# EasyEDA Pro project FrameworkGPU to MXM V0.4.epro, schematic Schematic1
Board Name: PCB3; Create Date: 2025-08-14; Page Name: P1; Project Name: FrameworkGPU to MXM V0.1; Schematic Name: Schematic1; Update Date: 2025-08-20; Company: EasyEDA.com; Page Size: A4; Version: V0.1
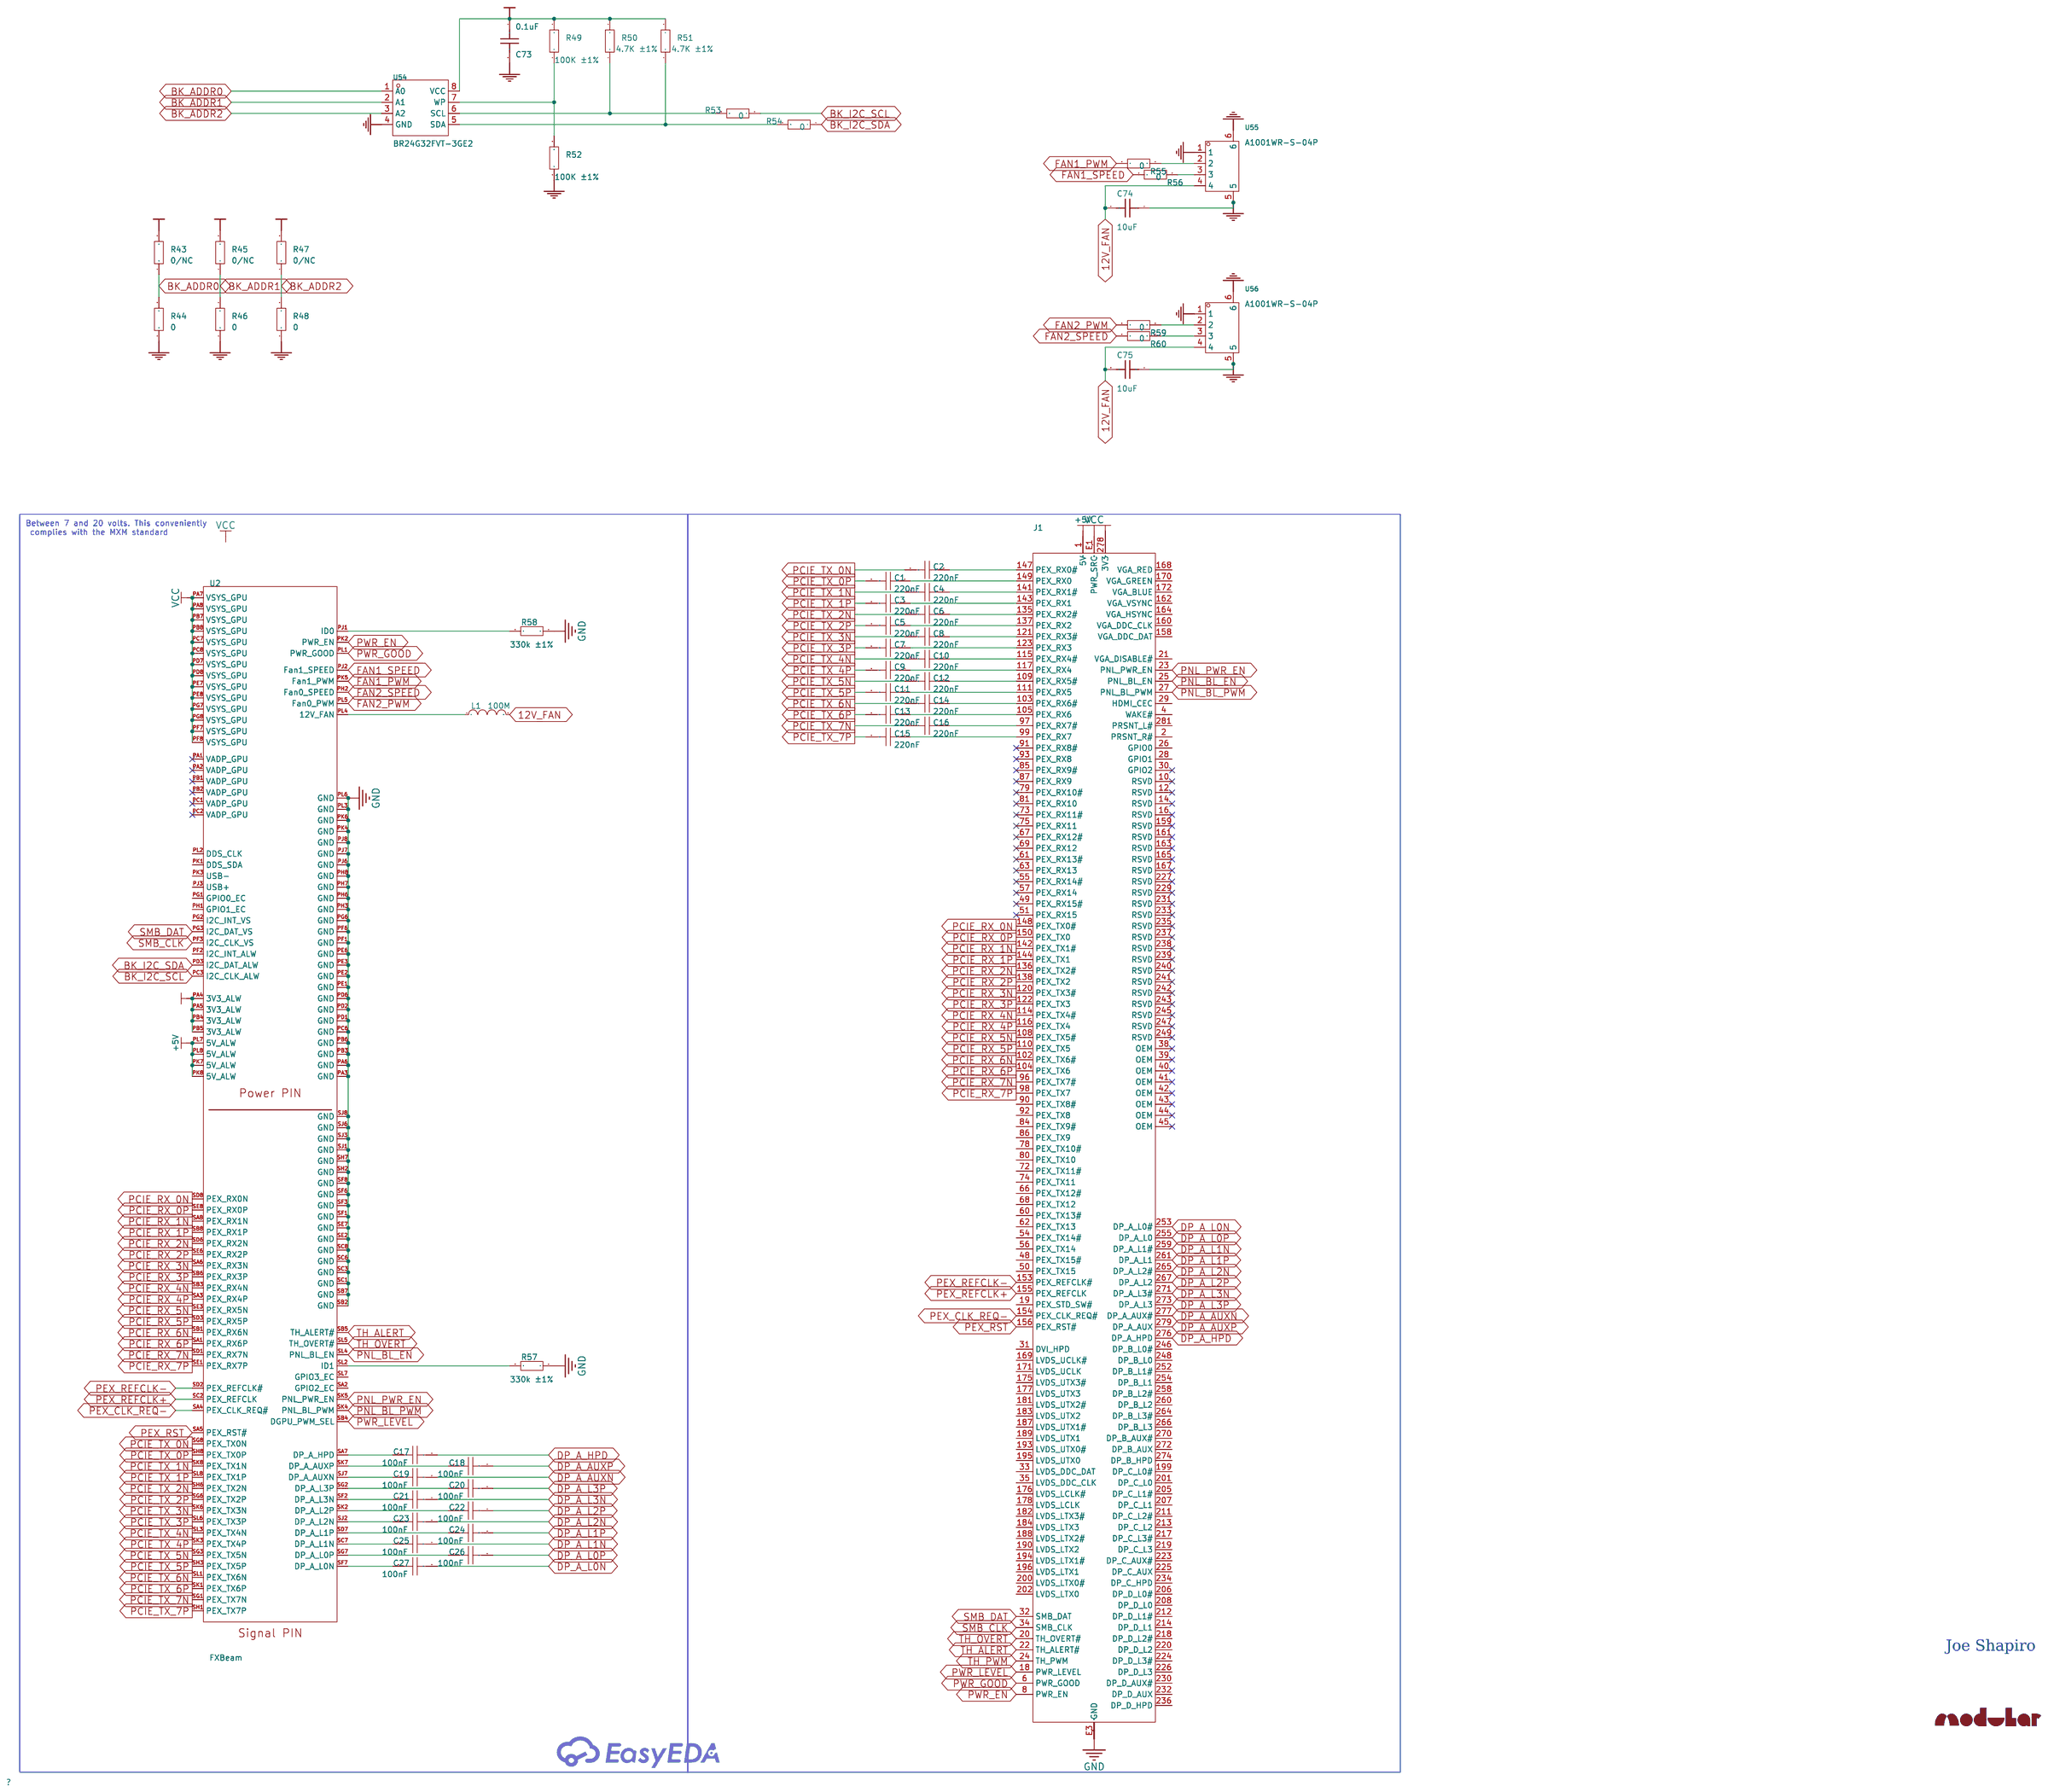
[diagram p0: schematic sheet]

## Parts
C1  220nF  [C0402]
C2  220nF  [C0402]
C3  220nF  [C0402]
C4  220nF  [C0402]
C5  220nF  [C0402]
C6  220nF  [C0402]
C7  220nF  [C0402]
C8  220nF  [C0402]
C9  220nF  [C0402]
C10  220nF  [C0402]
C11  220nF  [C0402]
C12  220nF  [C0402]
C13  220nF  [C0402]
C14  220nF  [C0402]
C15  220nF  [C0402]
C16  220nF  [C0402]
C17  100nF  [C0603]
C18  100nF  [C0603]
C19  100nF  [C0603]
C20  100nF  [C0603]
C21  100nF  [C0603]
C22  100nF  [C0603]
C23  100nF  [C0603]
C24  100nF  [C0603]
C25  100nF  [C0603]
C26  100nF  [C0603]
C27  100nF  [C0603]
C73  0.1uF  [C0402]
C74  10uF  [C0402]
C75  10uF  [C0402]
J1  MXM3.0  [CONN-SMD_314P-P0.50_10151114-001TLF]
L1  100M  [L0603]
R43  0/NC  [R0402]
R44  0  [R0402]
R45  0/NC  [R0402]
R46  0  [R0402]
R47  0/NC  [R0402]
R48  0  [R0402]
R49  100K ±1%  [R0402]
R50  4.7K ±1%  [R0402]
R51  4.7K ±1%  [R0402]
R52  100K ±1%  [R0402]
R53  0  [R0402]
R54  0  [R0402]
R55  0  [R0402]
R56  0  [R0402]
R57  330k ±1%  [R0402]
R58  330k ±1%  [R0402]
R59  0  [R0402]
R60  0  [R0402]
U2  FXBeam  [FW_FXBEAM_FULL]
U54  BR24G32FVT-3GE2  [TSSOP-8_L4.4-W3.0-P0.65-LS6.4-BL]
U55  A1001WR-S-04P  [CONN-SMD_A1001WR-S-04P]
U56  A1001WR-S-04P  [CONN-SMD_A1001WR-S-04P]

## Library data of the parts
C1-C27 = CAP_0603: Supplier Footprint: 0603
C73-C75 = 0.1uF: nameAlias: Value(F); Contributor: LCEDA_Lib; spicePre: C; spiceSymbolName: C_0603_US
J1 = MXM3.0
L1 = L_0603
R43-R60 = Res_0603: Supplier Footprint: 0603
U2 = FXBeam
U54 = BR24G32FVT-3GE2: Interface Type:I2C Memory Size:32Kbit Supply Voltage:1.6V~5.5V Supply Voltage:1.6V~5.5V Operating Temperature:-40℃~+85℃ Operating Temperature:-40℃~+85℃; Supplier Part: C2061284; Manufacturer: ROHM(罗姆); Supplier Footprint: TSSOP-8; JLCPCB Part Class: Extended Part; Datasheet: https://atta.szlcsc.com/upload/public/pdf/source/20211207/04F260C112D11C6089B8D1D4B01C0AA6.pdf; Supplier: LCSC; Interface Type: I2C; Memory Size: 32Kbit; Supply Voltage: 1.6V~5.5V; Operating Temperature: -40℃~+85℃
U55 U56 = A1001WR-S-04P: Pins Structure:1x4P Pitch:1mm Mounting Style:- Reference Series:- Number of Pins:4P Number of Rows:1 Number of PINs Per Row:4 Row Spacing:- Contact Material:Phosphor bronze; Supplier Part: C371510; Manufacturer: HR(灿达); Supplier Footprint: SMD,P=1mm; JLCPCB Part Class: Extended Part; Datasheet: https://atta.szlcsc.com/upload/public/pdf/source/20190214/C371578_09AF42C08FED26B3913BACEA5FD69D33.pdf; Supplier: LCSC; Pins Structure: 1x4P; Pitch: 1mm; Number of Pins: 4P; Number of Rows: 1; Number of PINs Per Row: 4; Contact Material: Phosphor bronze

## Nets
12V_FAN: C74.2 C75.2 L1.2 U55.4 U56.4
+3.3V: C73.1 J1.278(3V3) J1.280(3V3) R43.2 R45.2 R47.2 R49.2 R50.2 R51.2 U2.PA4(3V3_ALW) U2.PA5(3V3_ALW) U2.PB4(3V3_ALW) U2.PB5(3V3_ALW) U54.8(VCC)
+5V: J1.1(5V) J1.3(5V) J1.5(5V) J1.7(5V) J1.9(5V) U2.PK7(5V_ALW) U2.PK8(5V_ALW) U2.PL7(5V_ALW) U2.PL8(5V_ALW)
GND: C73.2 C74.1 C75.1 J1.11(GND) J1.13(GND) J1.15(GND) J1.17(GND) J1.36(GND) J1.37(GND) J1.46(GND) J1.47(GND) J1.52(GND) J1.53(GND) J1.58(GND) J1.59(GND) J1.64(GND) J1.65(GND) J1.70(GND) J1.71(GND) J1.76(GND) J1.77(GND) J1.82(GND) J1.83(GND) J1.88(GND) J1.89(GND) J1.94(GND) J1.95(GND) J1.100(GND) J1.101(GND) J1.106(GND) J1.107(GND) J1.112(GND) J1.113(GND) J1.118(GND) J1.119(GND) J1.124(GND) J1.125(GND) J1.133(GND) J1.134(GND) J1.139(GND) J1.140(GND) J1.145(GND) J1.146(GND) J1.151(GND) J1.152(GND) J1.157(GND) J1.166(GND) J1.173(GND) J1.174(GND) J1.179(GND) J1.180(GND) J1.185(GND) J1.186(GND) J1.191(GND) J1.192(GND) J1.197(GND) J1.198(GND) J1.203(GND) J1.204(GND) J1.209(GND) J1.210(GND) J1.215(GND) J1.216(GND) J1.221(GND) J1.222(GND) J1.228(GND) J1.244(GND) J1.250(GND) J1.251(GND) J1.256(GND) J1.257(GND) J1.262(GND) J1.263(GND) J1.268(GND) J1.269(GND) J1.275(GND) J1.E3(GND) J1.E4(GND) R44.1 R46.1 R48.1 R52.1 R57.1 R58.1 U2.PA3(GND) U2.PA6(GND) U2.PB3(GND) U2.PB6(GND) U2.PC6(GND) U2.PD1(GND) U2.PD2(GND) U2.PD6(GND) U2.PE1(GND) U2.PE2(GND) U2.PE3(GND) U2.PE6(GND) U2.PF1(GND) U2.PF6(GND) U2.PG6(GND) U2.PH3(GND) U2.PH6(GND) U2.PH7(GND) U2.PH8(GND) U2.PJ6(GND) U2.PJ7(GND) U2.PJ8(GND) U2.PK4(GND) U2.PK6(GND) U2.PL3(GND) U2.PL6(GND) U2.SB2(GND) U2.SB7(GND) U2.SC1(GND) U2.SC3(GND) U2.SC6(GND) U2.SC8(GND) U2.SE2(GND) U2.SE7(GND) U2.SF1(GND) U2.SF3(GND) U2.SF6(GND) U2.SF8(GND) U2.SH2(GND) U2.SH7(GND) U2.SJ1(GND) U2.SJ3(GND) U2.SJ6(GND) U2.SJ8(GND) U54.4(GND) U55.1 U55.5 U55.6 U56.1 U56.5 U56.6
VCC: J1.E1(PWR_SRC) J1.E2(PWR_SRC) U2.PA7(VSYS_GPU) U2.PA8(VSYS_GPU) U2.PB7(VSYS_GPU) U2.PB8(VSYS_GPU) U2.PC7(VSYS_GPU) U2.PC8(VSYS_GPU) U2.PD7(VSYS_GPU) U2.PD8(VSYS_GPU) U2.PE7(VSYS_GPU) U2.PE8(VSYS_GPU) U2.PF7(VSYS_GPU) U2.PF8(VSYS_GPU) U2.PG7(VSYS_GPU) U2.PG8(VSYS_GPU)
BK_ADDR0: R43.1 R44.2 U54.1(A0)
BK_ADDR1: R45.1 R46.2 U54.2(A1)
BK_ADDR2: R47.1 R48.2 U54.3(A2)
BK_I2C_SCL: R53.1 U2.PC3(I2C_CLK_ALW)
BK_I2C_SDA: R54.1 U2.PD3(I2C_DAT_ALW)
DP_A_AUXN: C19.1 J1.277(DP_A_AUX#)
DP_A_AUXP: C18.1 J1.279(DP_A_AUX)
DP_A_HPD: C17.1 J1.276(DP_A_HPD)
DP_A_L0N: C27.1 J1.253(DP_A_L0#)
DP_A_L0P: C26.1 J1.255(DP_A_L0)
DP_A_L1N: C25.1 J1.259(DP_A_L1#)
DP_A_L1P: C24.1 J1.261(DP_A_L1)
DP_A_L2N: C23.1 J1.265(DP_A_L2#)
DP_A_L2P: C22.1 J1.267(DP_A_L2)
DP_A_L3N: C21.1 J1.271(DP_A_L3#)
DP_A_L3P: C20.1 J1.273(DP_A_L3)
FAN1_PWM: R55.2 U2.PK5(Fan1_PWM)
FAN1_SPEED: R56.1 R56.2 U2.PJ2(Fan1_SPEED) U55.3
FAN2_PWM: R59.2 U2.PL5(Fan0_PWM)
FAN2_SPEED: R60.2 U2.PH2(Fan0_SPEED)
PCIE_RX_0N: J1.148(PEX_TX0#) U2.SD8(PEX_RX0N)
PCIE_RX_0P: J1.150(PEX_TX0) U2.SE8(PEX_RX0P)
PCIE_RX_1N: J1.142(PEX_TX1#) U2.SA8(PEX_RX1N)
PCIE_RX_1P: J1.144(PEX_TX1) U2.SB8(PEX_RX1P)
PCIE_RX_2N: J1.136(PEX_TX2#) U2.SD6(PEX_RX2N)
PCIE_RX_2P: J1.138(PEX_TX2) U2.SE6(PEX_RX2P)
PCIE_RX_3N: J1.120(PEX_TX3#) U2.SA6(PEX_RX3N)
PCIE_RX_3P: J1.122(PEX_TX3) U2.SB6(PEX_RX3P)
PCIE_RX_4N: J1.114(PEX_TX4#) U2.SB3(PEX_RX4N)
PCIE_RX_4P: J1.116(PEX_TX4) U2.SA3(PEX_RX4P)
PCIE_RX_5N: J1.108(PEX_TX5#) U2.SE3(PEX_RX5N)
PCIE_RX_5P: J1.110(PEX_TX5) U2.SD3(PEX_RX5P)
PCIE_RX_6N: J1.102(PEX_TX6#) U2.SB1(PEX_RX6N)
PCIE_RX_6P: J1.104(PEX_TX6) U2.SA1(PEX_RX6P)
PCIE_RX_7N: J1.96(PEX_TX7#) U2.SD1(PEX_RX7N)
PCIE_RX_7P: J1.98(PEX_TX7) U2.SE1(PEX_RX7P)
PCIE_TX_0N: C2.2 U2.SG8(PEX_TX0N)
PCIE_TX_0P: C1.2 U2.SH8(PEX_TX0P)
PCIE_TX_1N: C4.2 U2.SK8(PEX_TX1N)
PCIE_TX_1P: C3.2 U2.SL8(PEX_TX1P)
PCIE_TX_2N: C6.2 U2.SH6(PEX_TX2N)
PCIE_TX_2P: C5.2 U2.SG6(PEX_TX2P)
PCIE_TX_3N: C8.2 U2.SK6(PEX_TX3N)
PCIE_TX_3P: C7.2 U2.SL6(PEX_TX3P)
PCIE_TX_4N: C10.2 U2.SL3(PEX_TX4N)
PCIE_TX_4P: C9.2 U2.SK3(PEX_TX4P)
PCIE_TX_5N: C12.2 U2.SG3(PEX_TX5N)
PCIE_TX_5P: C11.2 U2.SH3(PEX_TX5P)
PCIE_TX_6N: C14.2 U2.SL1(PEX_TX6N)
PCIE_TX_6P: C13.2 U2.SK1(PEX_TX6P)
PCIE_TX_7N: C16.2 U2.SG1(PEX_TX7N)
PCIE_TX_7P: C15.2 U2.SH1(PEX_TX7P)
PEX_CLK_REQ-: J1.154(PEX_CLK_REQ#) U2.SA4(PEX_CLK_REQ#)
PEX_REFCLK+: J1.155(PEX_REFCLK) U2.SC2(PEX_REFCLK)
PEX_REFCLK-: J1.153(PEX_REFCLK#) U2.SD2(PEX_REFCLK#)
PEX_RST: J1.156(PEX_RST#) U2.SA5(PEX_RST#)
PNL_BL_EN: J1.25(PNL_BL_EN) U2.SL4(PNL_BL_EN)
PNL_BL_PWM: J1.27(PNL_BL_PWM) U2.SK4(PNL_BL_PWM)
PNL_PWR_EN: J1.23(PNL_PWR_EN) U2.SK5(PNL_PWR_EN)
PWR_EN: J1.8(PWR_EN) U2.PK2(PWR_EN)
PWR_GOOD: J1.6(PWR_GOOD) U2.PL1(PWR_GOOD)
PWR_LEVEL: J1.18(PWR_LEVEL) U2.SB4(DGPU_PWM_SEL)
SMB_CLK: J1.34(SMB_CLK) U2.PF3(I2C_CLK_VS)
SMB_DAT: J1.32(SMB_DAT) U2.PG3(I2C_DAT_VS)
TH_ALERT: J1.22(TH_ALERT#) U2.SB5(TH_ALERT#)
TH_OVERT: J1.20(TH_OVERT#) U2.SL5(TH_OVERT#)
TH_PWM: J1.24(TH_PWM)
$1N3802: C2.1 J1.147(PEX_RX0#)
$1N3808: C1.1 J1.149(PEX_RX0)
$1N3862: C3.1 J1.143(PEX_RX1)
$1N3868: C4.1 J1.141(PEX_RX1#)
$1N3922: C5.1 J1.137(PEX_RX2)
$1N3928: C6.1 J1.135(PEX_RX2#)
$1N3982: C7.1 J1.123(PEX_RX3)
$1N3988: C8.1 J1.121(PEX_RX3#)
$1N4042: C9.1 J1.117(PEX_RX4)
$1N4048: C10.1 J1.115(PEX_RX4#)
$1N4102: C11.1 J1.111(PEX_RX5)
$1N4108: C12.1 J1.109(PEX_RX5#)
$1N4162: C13.1 J1.105(PEX_RX6)
$1N4168: C14.1 J1.103(PEX_RX6#)
$1N4222: C15.1 J1.99(PEX_RX7)
$1N4228: C16.1 J1.97(PEX_RX7#)
$1N13346: C17.2 U2.SA7(DP_A_HPD)
$1N13376: C18.2 U2.SK7(DP_A_AUXP)
$1N13406: C19.2 U2.SJ7(DP_A_AUXN)
$1N13436: C20.2 U2.SG2(DP_A_L3P)
$1N13542: C22.2 U2.SK2(DP_A_L2P)
$1N13548: C21.2 U2.SF2(DP_A_L3N)
$1N13602: C24.2 U2.SD7(DP_A_L1P)
$1N13608: C23.2 U2.SJ2(DP_A_L2N)
$1N13662: C26.2 U2.SG7(DP_A_L0P)
$1N13668: C25.2 U2.SC7(DP_A_L1N)
$1N13722: C27.2 U2.SF7(DP_A_L0N)
$1N16911: R49.1 R52.2 U54.7(WP)
$1N16916: R50.1 R53.2 U54.6(SCL)
$1N16922: R51.1 R54.2 U54.5(SDA)
$1N17452: R55.1 U55.2
$1N17626: R57.2 U2.SL2(ID1)
$1N19602: R58.2 U2.PJ1(ID0)
$1N19683: R60.1 U56.3
$1N19689: R59.1 U56.2
$1N19713: L1.1 U2.PL4(12V_FAN)

Not connected (* = marked no-connect by the designer): J1 2(PRSNT_R#) 4(WAKE#) 10(RSVD)* 12(RSVD)* 14(RSVD)* 16(RSVD)* 19(PEX_STD_SW#) 21(VGA_DISABLE#) 26(GPIO0) 28(GPIO1) 29(HDMI_CEC) 30(GPIO2)* 31(DVI_HPD) 33(LVDS_DDC_DAT) 35(LVDS_DDC_CLK) 38(OEM)* 39(OEM)* 40(OEM)* 41(OEM)* 42(OEM)* 43(OEM)* 44(OEM)* 45(OEM)* 48(PEX_TX15#) 49(PEX_RX15#)* 50(PEX_TX15) 51(PEX_RX15)* 54(PEX_TX14#) 55(PEX_RX14#)* 56(PEX_TX14) 57(PEX_RX14)* 60(PEX_TX13#) 61(PEX_RX13#)* 62(PEX_TX13) 63(PEX_RX13)* 66(PEX_TX12#) 67(PEX_RX12#)* 68(PEX_TX12) 69(PEX_RX12)* 72(PEX_TX11#) 73(PEX_RX11#)* 74(PEX_TX11) 75(PEX_RX11)* 78(PEX_TX10#) 79(PEX_RX10#)* 80(PEX_TX10) 81(PEX_RX10)* 84(PEX_TX9#) 85(PEX_RX9#)* 86(PEX_TX9) 87(PEX_RX9)* 90(PEX_TX8#) 91(PEX_RX8#)* 92(PEX_TX8) 93(PEX_RX8)* 158(VGA_DDC_DAT) 159(RSVD)* 160(VGA_DDC_CLK) 161(RSVD)* 162(VGA_VSYNC) 163(RSVD)* 164(VGA_HSYNC) 165(RSVD)* 167(RSVD)* 168(VGA_RED) 169(LVDS_UCLK#) 170(VGA_GREEN) 171(LVDS_UCLK) 172(VGA_BLUE) 175(LVDS_UTX3#) 176(LVDS_LCLK#) 177(LVDS_UTX3) 178(LVDS_LCLK) 181(LVDS_UTX2#) 182(LVDS_LTX3#) 183(LVDS_UTX2) 184(LVDS_LTX3) 187(LVDS_UTX1#) 188(LVDS_LTX2#) 189(LVDS_UTX1) 190(LVDS_LTX2) 193(LVDS_UTX0#) 194(LVDS_LTX1#) 195(LVDS_UTX0) 196(LVDS_LTX1) 199(DP_C_L0#) 200(LVDS_LTX0#) 201(DP_C_L0) 202(LVDS_LTX0) 205(DP_C_L1#) 206(DP_D_L0#) 207(DP_C_L1) 208(DP_D_L0) 211(DP_C_L2#) 212(DP_D_L1#) 213(DP_C_L2) 214(DP_D_L1) 217(DP_C_L3#) 218(DP_D_L2#) 219(DP_C_L3) 220(DP_D_L2) 223(DP_C_AUX#) 224(DP_D_L3#) 225(DP_C_AUX) 226(DP_D_L3) 227(RSVD)* 229(RSVD)* 230(DP_D_AUX#) 231(RSVD)* 232(DP_D_AUX) 233(RSVD)* 234(DP_C_HPD) 235(RSVD)* 236(DP_D_HPD) 237(RSVD)* 238(RSVD)* 239(RSVD)* 240(RSVD)* 241(RSVD)* 242(RSVD)* 243(RSVD)* 245(RSVD)* 246(DP_B_L0#) 247(RSVD)* 248(DP_B_L0) 249(RSVD)* 252(DP_B_L1#) 254(DP_B_L1) 258(DP_B_L2#) 260(DP_B_L2) 264(DP_B_L3#) 266(DP_B_L3) 270(DP_B_AUX#) 272(DP_B_AUX) 274(DP_B_HPD) 281(PRSNT_L#); U2 PA1(VADP_GPU)* PA2(VADP_GPU)* PB1(VADP_GPU)* PB2(VADP_GPU)* PC1(VADP_GPU)* PC2(VADP_GPU)* PF2(I2C_INT_ALW) PG1(GPIO0_EC) PG2(I2C_INT_VS) PH1(GPIO1_EC) PJ3(USB+) PK1(DDS_SDA) PK3(USB-) PL2(DDS_CLK) SA2(GPIO2_EC) SL7(GPIO3_EC)

## Notes on the sheet
- Between 7 and 20 volts. This conveniently
   complies with the MXM standard
- Joe Shapiro
